# EAGLE design timerboard (EAGLE 7.2.0)
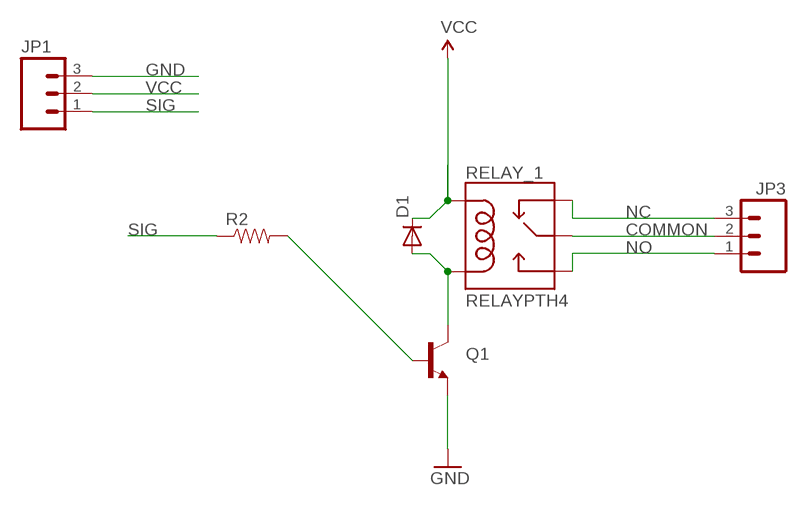
[diagram p0: schematic, sheet 1]

## Parts
D1  DIODE1N4148  [DIODE-1N4148]
JP1  M03PTH  [1X03]
JP3  M03-SCREW-5MM  [SCREWTERMINAL-5MM-3]
Q1  TRANSISTOR_NPNTO-92-AMMO  [TO-92-AMMO]
R2  RESISTORPTH-1/4W  [AXIAL-0.4]
RELAY_1  RELAYPTH4  [RELAY-JZC]

## Nets
COMMON: JP3.2 RELAY_1.4(MAIN)
GND: JP1.3 Q1.1(E)
N$2: D1.A Q1.3(C) RELAY_1.1(COIL2)
N$5: Q1.2(B) R2.P$2
NC: JP3.3 RELAY_1.2(NC)
NO: JP3.1 RELAY_1.3(NO)
SIG: JP1.1 R2.P$1
VCC: D1.C JP1.2 RELAY_1.5(COIL1)

## Library data of the parts
D1 = SparkFun:DIODE: Diode These are standard reverse protection diodes and small signal diodes. SMA package can handle up to about 1A. SOD-323 can handle about 200mA. What the SOD-323 package when ordering, there are some mfgs out there that are 5-pin packages.
JP1 = SparkFun-Connectors:M03: Header 3 Standard 3-pin 0.1" header. Use with straight break away headers (SKU : PRT-00116), right angle break away headers (PRT-00553), swiss pins (PRT-00743), machine pins (PRT-00117), and female headers (PRT-00115). Molex polarized connector foot print use with SKU : PRT-08232 with associated crimp pins and housings.
JP3 = SparkFun-Connectors:M03: Header 3 Standard 3-pin 0.1" header. Use with straight break away headers (SKU : PRT-00116), right angle break away headers (PRT-00553), swiss pins (PRT-00743), machine pins (PRT-00117), and female headers (PRT-00115). Molex polarized connector foot print use with SKU : PRT-08232 with associated crimp pins and housings.; STOREFRONT_ID: PRT-08433
Q1 = SparkFun:TRANSISTOR_NPN: Transistor NPN BJT configuration in SOT23 package. MMBT2222 is the common NPN we use. Double check BCE configuration again layout.
R2 = SparkFun:RESISTOR: Resistor Basic schematic elements and footprints for 0603, 1206, and PTH resistors.
RELAY_1 = SparkFun:RELAY

## Board
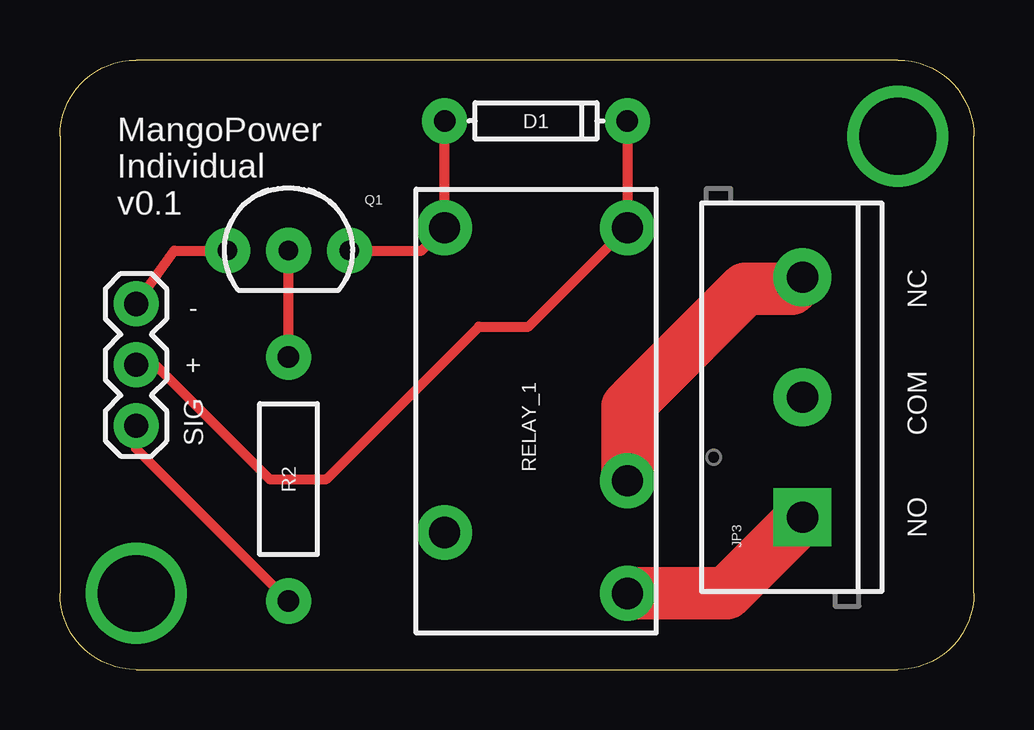
[diagram p1: board, top side]
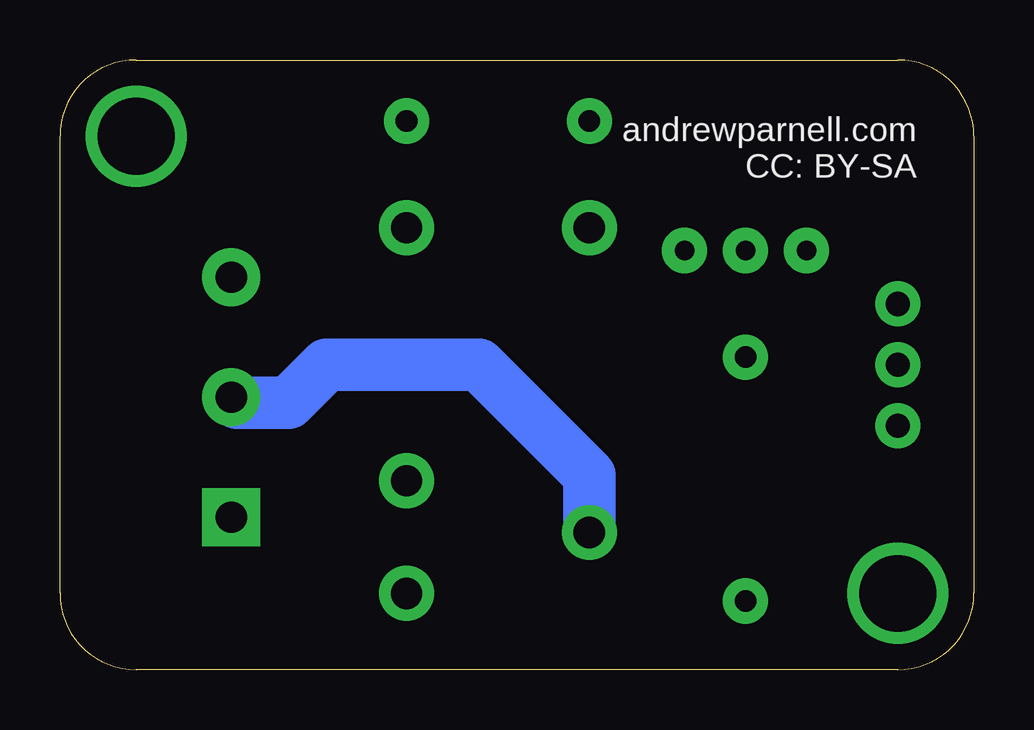
[diagram p2: board, bottom side, seen from below]

Size 38.1 x 25.4 mm. Coordinates in mm from the lower left corner, seen from the top.
Outline: 3.17,0 34.92,0 arc90 38.1,3.17 38.1,22.23 arc90 34.92,25.4 3.17,25.4 arc90 0,22.23 0,3.17 arc90 3.17,0
Copper layers (1*16): Top 0.0356mm / dielectric 1.5011mm / Bottom 0.0356mm
Design rules "LaenPCBOrder": minimum track width 6mil, minimum drill 13mil, track to track 6mil, track to pad 6mil, pad to pad 6mil, via to via 6mil, smd to smd 6mil, copper to edge 15mil, drill to drill 6mil, minimum pad ring 7mil, minimum via ring 7mil, stop-mask expansion 4mil, vias tented up to drill 0mil, thermal gap 10mil

### Footprints (pad centres in the part's own frame; a part is rotated, then mirrored left to right if it is on the bottom)
DIODE-1N4148 = drill 0.9 pad 1.88: A -3.81,0; C 3.81,0
1X03 = drill 1.016 pad 1.88: 1 0,0; 2 2.54,0; 3 5.08,0
SCREWTERMINAL-5MM-3 = drill 1.3 pad 2.413 square: 1 0,0 | drill 1.3 pad 2.413: 2 5,0; 3 10,0
TO-92-AMMO = drill 0.813 pad 1.88: 1 -2.54,0; 2 0,0; 3 2.54,0
AXIAL-0.4 = drill 0.9 pad 1.88: P$1 -5.08,0; P$2 5.08,0
RELAY-JZC = drill 1.3 pad 2.286: 1 3.81,-8.89; 2 -3.81,1.651; 3 -3.81,6.35; 4 3.81,3.81; 5 -3.81,-8.89

### Placement (x,y rotation side)
D1  19.84,22.86 0 top
JP1  3.17,10.16 90 top
JP3  30.96,6.35 90 top
Q1  9.53,17.46 0 top
R2  9.53,7.94 90 top
RELAY_1  19.84,9.53 180 top

### Tracks (layer width: path | path; a pad name or v marks a point on that pad's centre or on a via)
COMMON
  Bottom 2.184: RELAY_1.4 16.03,8.1 20.64,12.7 26.99,12.7 28.57,11.11 30.72,11.11 JP3.2
GND
  Top 0.406: JP1.3 4.76,17.46 Q1.1
N$1  (via drill 3.2 pad 0.25)
  other vias: 3.17,3.17
N$2
  Top 0.406: D1.A RELAY_1.1 15.08,17.46 Q1.3
N$3  (via drill 3.2 pad 0.25)
  other vias: 34.92,22.23
N$5
  Top 0.406: R2.P$2 Q1.2
NC
  Top 2.184: RELAY_1.2 23.65,10.95 28.57,15.88 30.48,15.88 JP3.3
NO
  Top 2.184: RELAY_1.3 27.78,3.17 JP3.1
SIG
  Top 0.406: JP1.1 3.17,9.21 R2.P$1
VCC
  Top 0.406: JP1.2 3.97,12.7 8.73,7.94 11.11,7.94 17.46,14.29 19.53,14.29 RELAY_1.5 D1.C

### Text on the board
_tsilk: MangoPower / Individual / v0.1 | NC | - | + | COM | SIG | NO
_bsilk: andrewparnell.com / CC: BY-SA